# Altium project dc-dc-converter.PrjPcb
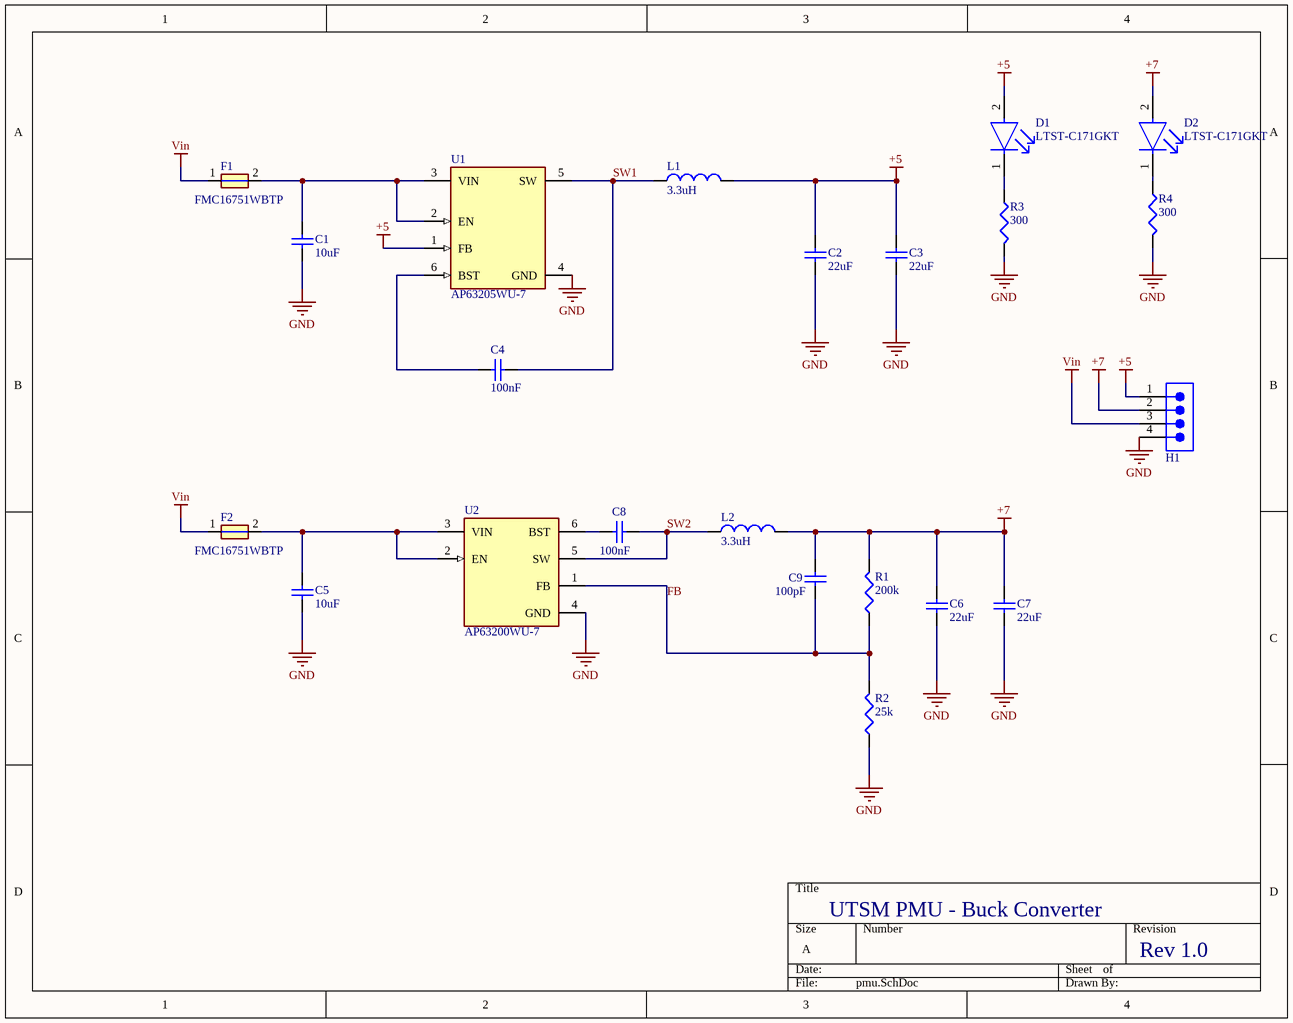
[diagram p0: pmu.SchDoc]
1 sheet, 22 parts. Net scope: global (net labels, ports and power ports of the same name join across sheets).
Board file: pmu.PcbDoc

## Sheet pmu.SchDoc
size A; SheetNumber: 1; SheetTotal: 1; SPICEModelCacheIUZUPHTK: <root> / <DocumentId>IUZUPHTK</DocumentId> / </root>

### Parts
C1  value 10uF  [0603c]  (hidden comment: Cap)
C2  value 22uF  [0603c]  (hidden comment: Cap)
C3  value 22uF  [0603c]  (hidden comment: Cap)
C4  value 100nF  [0603c]  (hidden comment: Cap)
C5  value 10uF  [0603c]  (hidden comment: Cap)
C6  value 22uF  [0603c]  (hidden comment: Cap)
C7  value 22uF  [0603c]  (hidden comment: Cap)
C8  value 100nF  [0603c]  (hidden comment: Cap)
C9  value 100pF  [0603c]  (hidden comment: Cap)
D1  LTST-C171GKT  [FP-LTST-C171GKT-MFG]
D2  LTST-C171GKT  [FP-LTST-C171GKT-MFG]
F1  FMC16751WBTP  [FUSC1608X64N]
F2  FMC16751WBTP  [FUSC1608X64N]
H1  61300411121  [61300411121]  (value not drawn)
L1  3.3uH  [1210]
L2  3.3uH  [1210]
R1  value 200k  [0603r]  (hidden comment: Res3)
R2  value 25k  [0603r]  (hidden comment: Res3)
R3  value 300  [0603r]
R4  value 300  [0603r]
U1  AP63205WU-7  [FP-TSOT26-MFG]
U2  AP63200WU-7  [FP-TSOT26-MFG]

### Nets
+5: C2.2 C3.2 D1.2(A) H1.1 L1.P$2 U1.1(FB)
+7: C6.2 C7.2 C9.2 D2.2(A) H1.2 L2.P$2 R1.2
GND: C1.1 C2.1 C3.1 C5.1 C6.1 C7.1 H1.4 R2.1 R3.2 R4.2 U1.4(GND) U2.4(GND)
Vin: F1.1 F2.1 H1.3
FB: C9.1 R1.1 R2.2 U2.1(FB)
SW1: C4.2 L1.P$1 U1.5(SW)
SW2: C8.2 L2.P$1 U2.5(SW)
NetC1_2: C1.2 F1.2 U1.2(EN) U1.3(VIN)
NetC4_1: C4.1 U1.6(BST)
NetC5_2: C5.2 F2.2 U2.2(EN) U2.3(VIN)
NetC8_1: C8.1 U2.6(BST)
NetD1_1: D1.1(C) R3.1
NetD2_1: D2.1(C) R4.1

### Notes on the sheet
- UTSM PMU - Buck Converter
- Rev 1.0

### Library data of the parts
C1 C5 = Cap: SMD Capacitor / CL21A106KOQNNNG; Published: 8-Jun-2000; LatestRevisionDate: 17-Jul-2002; LatestRevisionNote: Re-released for DXP Platform.; PackageReference: RAD-0.3; Publisher: Altium Limited; PackageDescription: Radial Cap, Thru-Hole; 2 Leads; 0.3 in Pin Spacing
C2-C4 C6-C9 = Cap: SMD Capacitor; Published: 8-Jun-2000; LatestRevisionDate: 17-Jul-2002; LatestRevisionNote: Re-released for DXP Platform.; PackageReference: RAD-0.3; Publisher: Altium Limited; PackageDescription: Radial Cap, Thru-Hole; 2 Leads; 0.3 in Pin Spacing
D1 D2 = CMP-22017-000007-1: LED GREEN CLEAR CHIP SMD; Luminous Intensity: 12mcd; Lens Color: Colorless; Dominant Wavelength: 569nm; Number of LEDs: 1; Power Dissipation: 100mW; Viewing Angle: 130°; Reverse Voltage: 5V; Test Current: 10mA; Forward Voltage: 2.1V; Wavelength: 585nm; Lens Style: Diffused; Forward Current: 30mA; Height: 0.8mm; Mount: Surface Mount; Package Quantity: 1; Length: 2mm; Case Code (Metric): 2012; Number of Pins: 2; Number of Elements: 1; Packaging: Tape and Reel; Color: Green; Min Operating Temperature: -55°C; Case/Package: 0805; Power Rating: 100mW; Max Operating Temperature: 85°C; Radiation Hardening: No; Depth: 1.25mm; Lens Transparency: Clear; Width: 1.25mm; Lead Free: Lead Free; Case Code (Imperial): 0805; Illumination Color: Green
F1 F2 = ERB-RE1R00V: 0.8A - FMC16801WHTP / 0.75A - FMC16751WBTP; MF: Panasonic; Package: 0603 Panasonic Electronic Components; MP: ERB-RE1R00V; Check_prices: https://www.snapeda.com/parts/ERB-RE1R00V/Panasonic/view-part/?ref=eda; Purchase-URL: https://pricing.snapeda.com/search/part/ERB-RE1R00V/?ref=eda; Value: *; Availability: In Stock; Price: None; SnapEDA_Link: https://www.snapeda.com/parts/ERB-RE1R00V/Panasonic/view-part/?ref=snap
H1 = 61300411121: WR-PHD Pin Header, THT, Vertical, pitch 2.54mm, 1 Row, 4P; Manufacturer: Wurth Elektronik; Contact Resistance: 20mOhm; Rated Current: 3A; Working Voltage: 250V; Withstanding Voltage: 500V; Manufacturer Part Number: 61300411121; Category: Board-to-Board Connectors; Match Code: WR-PHD; ComponentLink1Description: Website Link; ComponentLink1URL: https://www.we-online.com/redexpert/article/61300411121?ad; ComponentLink2Description: Datasheet Link; ComponentLink2URL: https://www.we-online.com/redexpert/spec/61300411121?ad; Mount: Through Hole; Operating Temperature Max: 105°C; Operating Temperature Min: -40°C; Packaging: Bag; Gender: Pin Header; Number of Pins: 4; Number of Rows: 1; Orientation: Vertical; Pitch: 2.54mm
L1 L2 = Ind: SMD Inductor / SRP3212-3R3M; MF: Bourns; MP: SRP3212-4R7M; Package: None; Price: None; Check_prices: https://www.snapeda.com/parts/SRP3212-4R7M/Bourns/view-part/?ref=eda; Value: *; SnapEDA_Link: https://www.snapeda.com/parts/SRP3212-4R7M/Bourns/view-part/?ref=snap; Availability: In Stock; Purchase-URL: https://pricing.snapeda.com/search/part/SRP3212-4R7M/?ref=eda
R1-R4 = Res3: SMD Resistor; Published: 8-Jun-2000; LatestRevisionDate: 29-May-2009; LatestRevisionNote: IPC-7351 Footprint Added.; PackageReference: J1-0603; Publisher: Altium Limited; PackageDescription: Chip Resistor
U1 = CMP-12757-000001-1: IC REG BUCK 5V 2A TSOT26; Manufacturer: Diodes Inc.; Max Junction Temp: +160°C; Max Duty Cycle: 100%; Standoff Height: 0.01mm; Max Supply Voltage: 32V; Number Of Outputs: 1; Min Supply Voltage: 3.8V; Output Type: Fixed; Switching Frequency: 1100kHz; Nominal Supply Current: 22uA; Automotive: No; RoHS: TRUE; Switching Topology: Buck; Temperature: -40°C to +85°C; Footprint Url: https://www.diodes.com/assets/Package-Files/TSOT26.pdf; Lead Free: Yes; Digikey Description: IC REG BUCK 5V 2A TSOT26; Device Class L3: Voltage Regulators - Switching; Ambient Temperature Range High: +85°C; Category: IC; Package: TSOT26; Output Voltage: 5V; Output Current: 2A; ComponentLink2Description: Datasheet; Device Class L2: Power Management ICs; Ambient Temperature Range Low: -40°C; Temperature Range High: +85°C; Temperature Range Low: -40°C; Octopart: https://octopart.com/ap63205wu-7-diodes+inc.-98099551; Manufacturer Part Number: AP63205WU-7; Height: 1mm; Device Class L1: Integrated Circuits (ICs); ComponentLink2URL: https://www.diodes.com/assets/Datasheets/AP63200-AP63201-AP63203-AP63205.pdf
U2 = CMP-12757-000010-1: IC REG BUCK ADJUSTABLE 2A TSOT26; Manufacturer: Diodes Inc.; Switching Frequency: 500kHz; Max Supply Voltage: 32V; Number Of Outputs: 1; Nominal Supply Current: 22uA; Min Supply Voltage: 3.8V; Output Type: AdjustableProgrammable; Max Junction Temp: +160°C; Standoff Height: 0.01mm; Octopart: https://octopart.com/ap63200wu-7-diodes+inc.-98099548; Height: 1mm; Temperature Range Low: -40°C; Output Current: 2A; ComponentLink2URL: https://www.diodes.com/assets/Datasheets/AP63200-AP63201-AP63203-AP63205.pdf; Switching Topology: Buck; Automotive: No; Device Class L1: Integrated Circuits (ICs); Ipc Land Pattern Name: SOT95P280X100-6; Package: TSOT26; Temperature Range High: +85°C; RoHS: TRUE; Ambient Temperature Range High: +85°C; Device Class L3: Voltage Regulators - Switching; Temperature: -40°C to +85°C; Device Class L2: Power Management ICs; Footprint Url: https://www.diodes.com/assets/Package-Files/TSOT26.pdf; Mouser Description: AP63200 Series 1.2 V 2 A Adjustable Synchronous Buck Converter - TSOT-26; Category: IC; ComponentLink2Description: Datasheet; Digikey Description: IC REG BUCK ADJUSTABLE 2A TSOT26; Lead Free: Yes; Ambient Temperature Range Low: -40°C; Manufacturer Part Number: AP63200WU-7